# Altium schematic sheet Connections.SchDoc
size A4
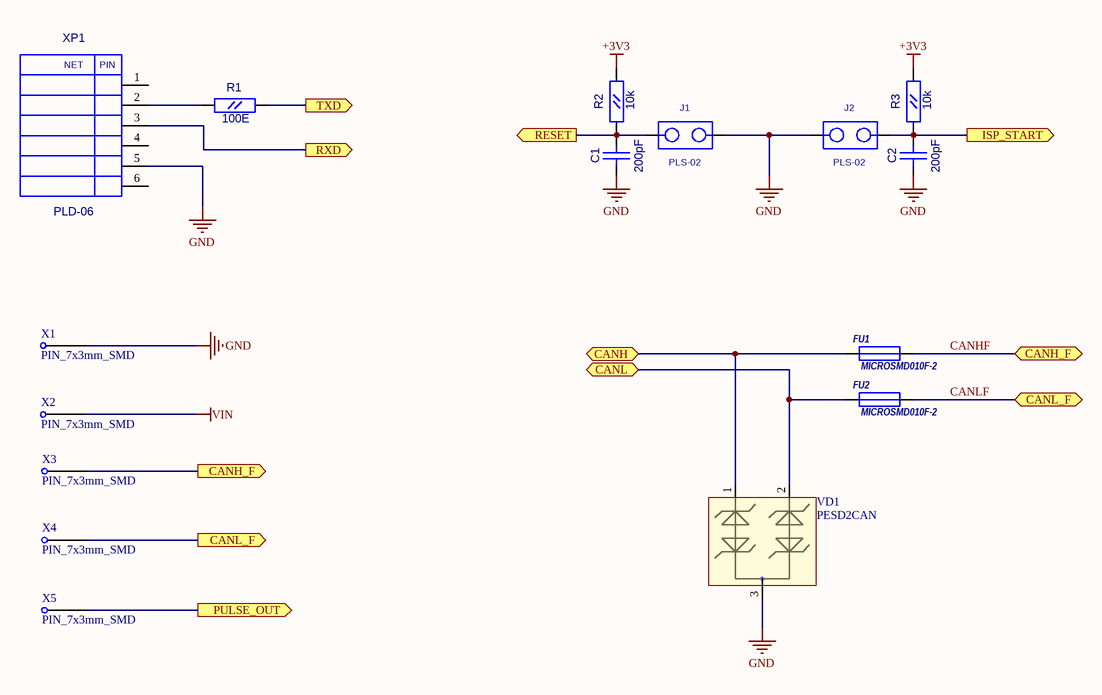
[diagram p0: Connections.SchDoc]

## Parts
C1  200pF  [CC0603]
C2  200pF  [CC0603]
FU1  MICROSMD010F-2  [RC1210]
FU2  MICROSMD010F-2  [RC1210]
J1  PLS-02  [PLS-02]
J2  PLS-02  [PLS-02]
R1  100E  [RC0603]
R2  10k  [RC0603]
R3  10k  [RC0603]
VD1  PESD2CAN  [SOT-23(123)]
X1  PIN_7x3mm_SMD  [PIN_7x3mm_SMD]
X2  PIN_7x3mm_SMD  [PIN_7x3mm_SMD]
X3  PIN_7x3mm_SMD  [PIN_7x3mm_SMD]
X4  PIN_7x3mm_SMD  [PIN_7x3mm_SMD]
X5  PIN_7x3mm_SMD  [PIN_7x3mm_SMD]
XP1  PLD-06  [PIN6]

## Ports
CANH, CANH_F, CANH_F (out), CANL, CANL_F, CANL_F (out), ISP_START (out), PULSE_OUT (out), RESET (out), RXD (out), TXD (out)

## Nets
+3V3: R2.2(B) R3.2(B)
GND: C1.1(A) C2.1(A) J1.2 J2.1 VD1.3 X1.1 XP1.5
VIN: X2.1
CANH: FU1.1 VD1.1 ; port CANH
CANHF: FU1.2 X3.1 ; port CANH_F
CANL: FU2.1 VD1.2 ; port CANL
CANLF: FU2.2 X4.1 ; port CANL_F
ISP_START: C2.2(B) J2.2 R3.1(A) ; port ISP_START
PULSE_OUT: X5.1 ; port PULSE_OUT
RESET: C1.2(B) J1.1 R2.1(A) ; port RESET
RXD: XP1.3 ; port RXD
TXD: R1.2(B) ; port TXD
NetR1_1: R1.1(A) XP1.2

Not connected (* = marked no-connect by the designer): XP1 1 4 6

## Notes on the sheet
- (in symbol PLD-06) NET; PIN

## Library data of the parts
C1 C2 = CC0603: Value: 200pF
FU1 FU2 = MICROSMD: Value: MICROSMD010F-2
R1-R3 = RC0603
  R1: Value: 100E
  R2 R3: Value: 10k
VD1 = PESD2CAN: TVS for CAN
XP1 = PLD-06: PLD06; Value: *
J1 J2 = PLS-02: Value: *